# EasyEDA Pro project eLight_core.epro, board PCB_5w
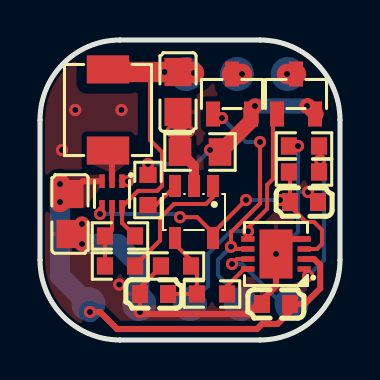
[diagram p13: board, top side]
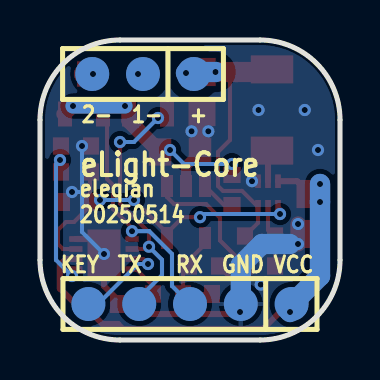
[diagram p14: board, bottom side, seen from below]

Outline 15 x 15 mm; copper layers: Top Layer, Bottom Layer. Coordinates in mm from the lower left corner of the outline.
Outline path: 0,11 0,4 arc(1.17,1.17) 4,0 11,0 arc(13.83,1.17) 15,4 15,11 arc(13.83,13.83) 11,15 4,15 arc(1.17,13.83) 0,11
Stack: Top Layer 0.035mm / Dielectric1 0.71mm FR4 er 4.5 / Bottom Layer 0.035mm

## Design rules (mm)
template: 用户自定义配置
spacing safeClearance (default): track to track 0.152, other pairs 0.152 to 0.3
track width trackWidth (default): min 0.127, default 0.254, max 2.54
differential pair differentialPair (default): width min 0.127, default 0.254, max 2.54; gap min 0.152, default 0.152
via viaSize (default): diameter min 0.5, default 0.61, max 10; hole min 0.3, default 0.305, max 5.999
net $1N3207 uses copperRegion1
net LED+ uses copperRegion1

## Placement (name value [footprint] x y rotation side)
C1  1uF  [C0603]  11.8 1.8 0 top
C3  22uF  [C0805]  6.9 12.4 90 top
C4  22uF  [C0805]  1.5 6.3 90 top
C5  100nF  [C0603]  13.2 6.9 180 top
C6  1uF  [C0603]  5.7 2.3 0 top
H1  PZ254V-11-05P  [HDR-TH_5P-P2.54-V-M]  7.5 1.8 0 bottom
H2  PZ254V-11-03P  [HDR-TH_3P-P2.54-V-M]  9.85 13.3 0 bottom
L1  1uH  [IND-SMD_L4.4-W4.2]  3.4 11.5 270 top
Q1  SI2300  [SOT-23-3_L2.9-W1.3-P1.90-LS2.4-BR]  9.6 12.3 270 top
Q2  SI2300  [SOT-23-3_L2.9-W1.3-P1.90-LS2.4-BR]  12.8 12.3 270 top
R1  100kΩ  [R0603]  13.2 8.4 180 top
R2  SDNT1608X104F4250FTF  [R0603]  13.2 9.7 0 top
R3  10kΩ  [R0603]  4 3.7 180 top
R4  1kΩ  [R0603]  5.4 7.5 270 top
R5  20mΩ  [R0805]  8 9.4 0 top
R6  100kΩ  [R0603]  8.6 2.3 180 top
R7  1kΩ  [R0603]  6.8 3.7 0 top
R8  51kΩ  [R0603]  4 5.2 0 top
U1  STC8G1K08A-36I-DFN8  [DFN-8_L3.0-W3.0-P0.50-BL-EP]  11.8 4.3 90 top
U2  ETA3521FSG  [SOT-563-6_L1.6-W1.2-P0.5-LS1.6-BR]  3.6 7.3 90 top
U3  GS8551-TR  [SOT-23-5_L3.0-W1.7-P0.95-LS2.8-BR]  7.7 6.4 90 top

## Footprints (pads in the part's own frame, mm; a bottom-side part is the same pattern mirrored in y, then rotated)
C0603
  rect 0.8x0.9 smd: 1(-0.7,0) 2(0.7,0)
C0805
  rect 1.41x1.35 smd: 1(-1,0) 2(1,0)
DFN-8_L3.0-W3.0-P0.50-BL-EP
  rect 0.28x0.665 smd: 1(-0.75,-1.407) 2(-0.25,-1.407) 3(0.25,-1.407) 4(0.75,-1.407) 5(0.75,1.407) 6(0.25,1.407) 7(-0.25,1.407) 8(-0.75,1.407)
  rect 2.45x1.65 smd: 9(0,0)
HDR-TH_3P-P2.54-V-M
  round 1.7 smd: 1(-2.54,0) 2(0,0) 3(2.54,0)
HDR-TH_5P-P2.54-V-M
  round 1.7 smd: 1(-5.08,0) 2(-2.54,0) 3(0,0) 4(2.54,0) 5(5.08,0)
IND-SMD_L4.4-W4.2
  rect 1.4x2.12 smd: 1(2.028,0) 2(-2.028,0)
R0603
  rect 0.806x0.864 smd: 1(-0.753,0) 2(0.753,0)
R0805
  rect 1.133x1.377 smd: 1(-1,0) 2(1,0)
SOT-23-3_L2.9-W1.3-P1.90-LS2.4-BR
  rect 1.25x0.7 smd: 1(1,-0.95) 2(1,0.95) 3(-1,0)
SOT-23-5_L3.0-W1.7-P0.95-LS2.8-BR
  rect 1.1x0.6 smd: 1(1.3,-0.95) 2(1.3,0) 3(1.3,0.95) 4(-1.3,0.95) 5(-1.3,-0.95)
SOT-563-6_L1.6-W1.2-P0.5-LS1.6-BR
  rect 0.68x0.28 smd: 1(0.64,-0.5) 2(0.64,0) 3(0.64,0.5) 4(-0.64,0.5) 5(-0.64,0) 6(-0.64,-0.5)

## Nets
As in the schematic.

## Via types
v1: diameter 0.61, hole 0.305, Top Layer to Bottom Layer, 35 vias

## Routing (per net, layer and track width the routed paths; a pad name or vN(x,y) marks a point on that pad's centre or on a via; arc(x,y) is an arc through that point)
GND: length 31.5
  Top Layer w0.203: R7.1 6.05,3.67 5,2.62 C6.1 v1(5,1.4) ; R2.1 v1(12.9,9.7) ; C5.1 v1(13.4,7.4)
  Top Layer w0.305: U2.1 v1(4.4,7.94) ; U1.4 12.55,5.05 v1(11.8,4.3) 11.8,2.7 10.4,1.3 5.1,1.3 v1(5,1.4)
  Top Layer w0.508: R5.1 7.7,8.7 U3.2
  Top Layer w0.762: v1(2.1,5.8) 2.1,4.8
  Top Layer w1.016: R5.1 7,11.3 C3.1
  Bottom Layer w0.203: v1(12.9,9.7) 12.9,7.46 ; 12.9,7.46 12.96,7.4 v1(13.4,7.4) ; 12.9,7.46 12.9,5.4 v1(11.8,4.3)
  Bottom Layer w0.305: 4.96,1.44 H1.2
  Bottom Layer w1.016: H1.2 4.96,3.74 3.9,4.8 2.5,4.8
  vias: v1(1.1,9.5) v1(1.76,11.5) v1(2.1,4.8) v1(3.96,2.77) v1(4.07,11.5) v1(6.59,10.44) v1(7.42,10.44)
VCC: length 24.8
  Top Layer w0.305: U2.3 2.14,7.94 C4.2 ; U1.2 13.71,4.05 14.01,3.75 14.01,2.58 13.23,1.8 C1.2 12.5,1.42 11.88,0.8 11.1,0.8 10.85,0.55 3.85,0.55 3,1.4 v1(2.5,1.4)
  Top Layer w1.016: v1(1,7.8) v1(1,6.9)
  Bottom Layer w1.016: v1(2.5,1.4) 2.5,1.7 1,3.2 v1(1,6.9) v1(1,7.8)
DIM: length 1.8
  Top Layer w0.203: U1.8 10.2,3.55 9.35,2.7 R6.1
EN1: length 13.3
  Top Layer w0.203: v1(9.1,11.1) 8.85,11.1 Q1.1 ; v1(11,9.9) 11,6.83 9.55,5.38 v1(9.55,4.66) 9.66,4.55 U1.6
  Bottom Layer w0.203: v1(9.1,11.1) 10.3,9.9 v1(11,9.9) ; v1(9.55,4.66) 8.9,4.01 8.9,3.24 10.04,2.1 H1.4
EN2: length 12.2
  Top Layer w0.203: Q2.1 11.65,11.1 11.65,8.05 11.36,7.76 11.36,6.56 10.39,5.59 U1.5
  Bottom Layer w0.203: v1(10.4,5.44) 9.54,5.44 8.4,4.3 8.4,2.7 H1.3
KEY: length 4.7
  Top Layer w0.203: v1(9.6,3.8) 9.85,4.05 U1.7
  Bottom Layer w0.203: H1.5 12.1,1.8 10.1,3.8 v1(9.6,3.8)
L_EN: length 16.8
  Top Layer w0.203: U2.4 3,6.56 v1(3,6.3) ; 8.65,5.35 v1(10.3,7) ; 8.65,5.35 7.86,6.14 v1(7,6.14) ; 8.65,5.35 U3.5 ; C5.2 12.5,8.35 R1.2 ; C5.2 12.5,6.7 13.3,5.9 13.7,5.9 14.1,5.5 14.1,4.8 13.85,4.55 U1.3 ; C5.2 12.4,7 v1(12,7)
  Bottom Layer w0.203: v1(3,6.3) 6.84,6.3 v1(7,6.14) ; v1(10.3,7) v1(12,7)
LED+: length 16.1
  Top Layer w0.203: 5.18,13.4 5.5,13.08 5.5,10 6.1,9.4 6.1,7.7 5.86,7.46 4.9,7.46 4.1,6.66 U2.6 4.1,5.85 R8.2
  Top Layer w1.016: L1.2 3.53,13.4 v1(6.23,13.4) C3.2 7.65,13.4 v1(7.7,13.35)
  Bottom Layer w1.016: v1(6.23,13.4) 7.65,13.4 v1(7.7,13.35)
LED-: length 10.7
  Top Layer w0.203: R4.1 v1(5.4,8.8) ; v1(8.5,9.5) 8.9,9.5 R5.2
  Top Layer w0.762: v1(13.35,11.7) 13.4,11.7 13.8,11.3 ; v1(10.75,11.7) 10.55,11.5 10.55,10.95 R5.2
  Bottom Layer w0.203: v1(5.4,8.8) 7.8,8.8 v1(8.5,9.5)
  Bottom Layer w0.762: v1(13.35,11.7) v1(10.75,11.7)
NTC: length 8
  Top Layer w0.203: R1.1 14,8.45 v1(14,9) 14,9.3 13.95,9.35 R2.2 ; U1.1 13.4,3.36 v1(13.4,3.2)
  Bottom Layer w0.203: v1(14,9) 14.2,8.8 14.2,4 v1(13.4,3.2)
$1N3190: length 1.6
  Top Layer w0.305: L1.1 3.6,9.27 U2.2
$1N3207: length 0.5
  Top Layer w1.016: Q1.3 v1(10.1,13.3)
$1N7267: length 0.5
  Top Layer w1.016: v1(12.35,13.3) Q2.3
  Bottom Layer w0.508: v1(12.35,13.3) H2.3
$1N46286: length 4.7
  Top Layer w0.203: C6.2 R6.2 7.85,3.41 R7.2 7.55,3.99 6.75,4.79 U3.4
$1N46290: length 1.7
  Top Layer w0.203: U3.3 5.8,6.75 R4.2
$1N46943: length 3.1
  Top Layer w0.203: R3.2 3.25,5.15 3.6,5.5 U2.5
$1N46953: length 6.6
  Top Layer w0.203: R3.1 4.75,3.73 6,4.98 6,6.1 6.7,6.8 8.3,6.8 8.65,7.15 U3.1

## Copper pours and planes (outline as drawn; the poured copper is in the pictures)
GND on Top Layer: 0,15.02 14.99,15.02 14.99,0.02 0,0.02
GND on Bottom Layer: -0.01,15.04 14.99,15.04 14.99,0.02 -0.01,0.02
GND on Bottom Layer: 0,15.02 15.1,15.02 15.1,0.01 0,0.01
VCC on Top Layer: 0.75,8.26 3.14,8.26 3.14,6.6 0.75,6.6
$1N3190 on Top Layer: 2.4,8.9 4.43,8.9 4.43,8.27 2.4,8.27

## Text on the board
Bottom Silkscreen Layer: VCC | GND | + | RX | 1- | TX | 2- | KEY | eleqian | 20250514 | eLight-Core
